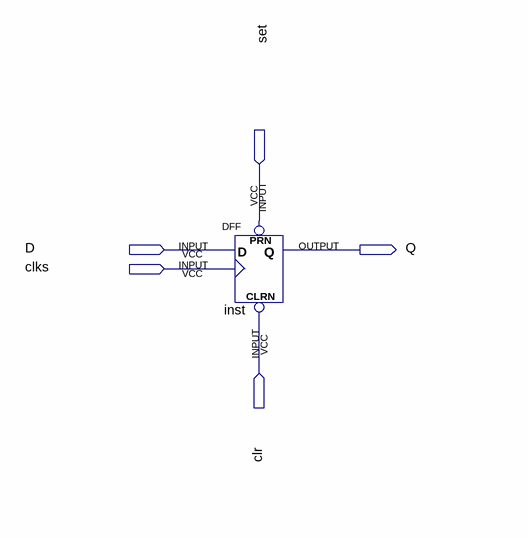
[diagram p0: schematic sheet]
// Quartus schematic testDFF.bdf as structural Verilog: 1 symbols, 5 pins
module testDFF (
  input  set,
  input  D,
  input  clks,
  input  clr,
  output Q
);

  DFF inst (.CLRN(clr), .CLK(clks), .D(D), .PRN(set), .Q(Q));
endmodule
